# EAGLE design PortExpander (EAGLE 8.2.2)
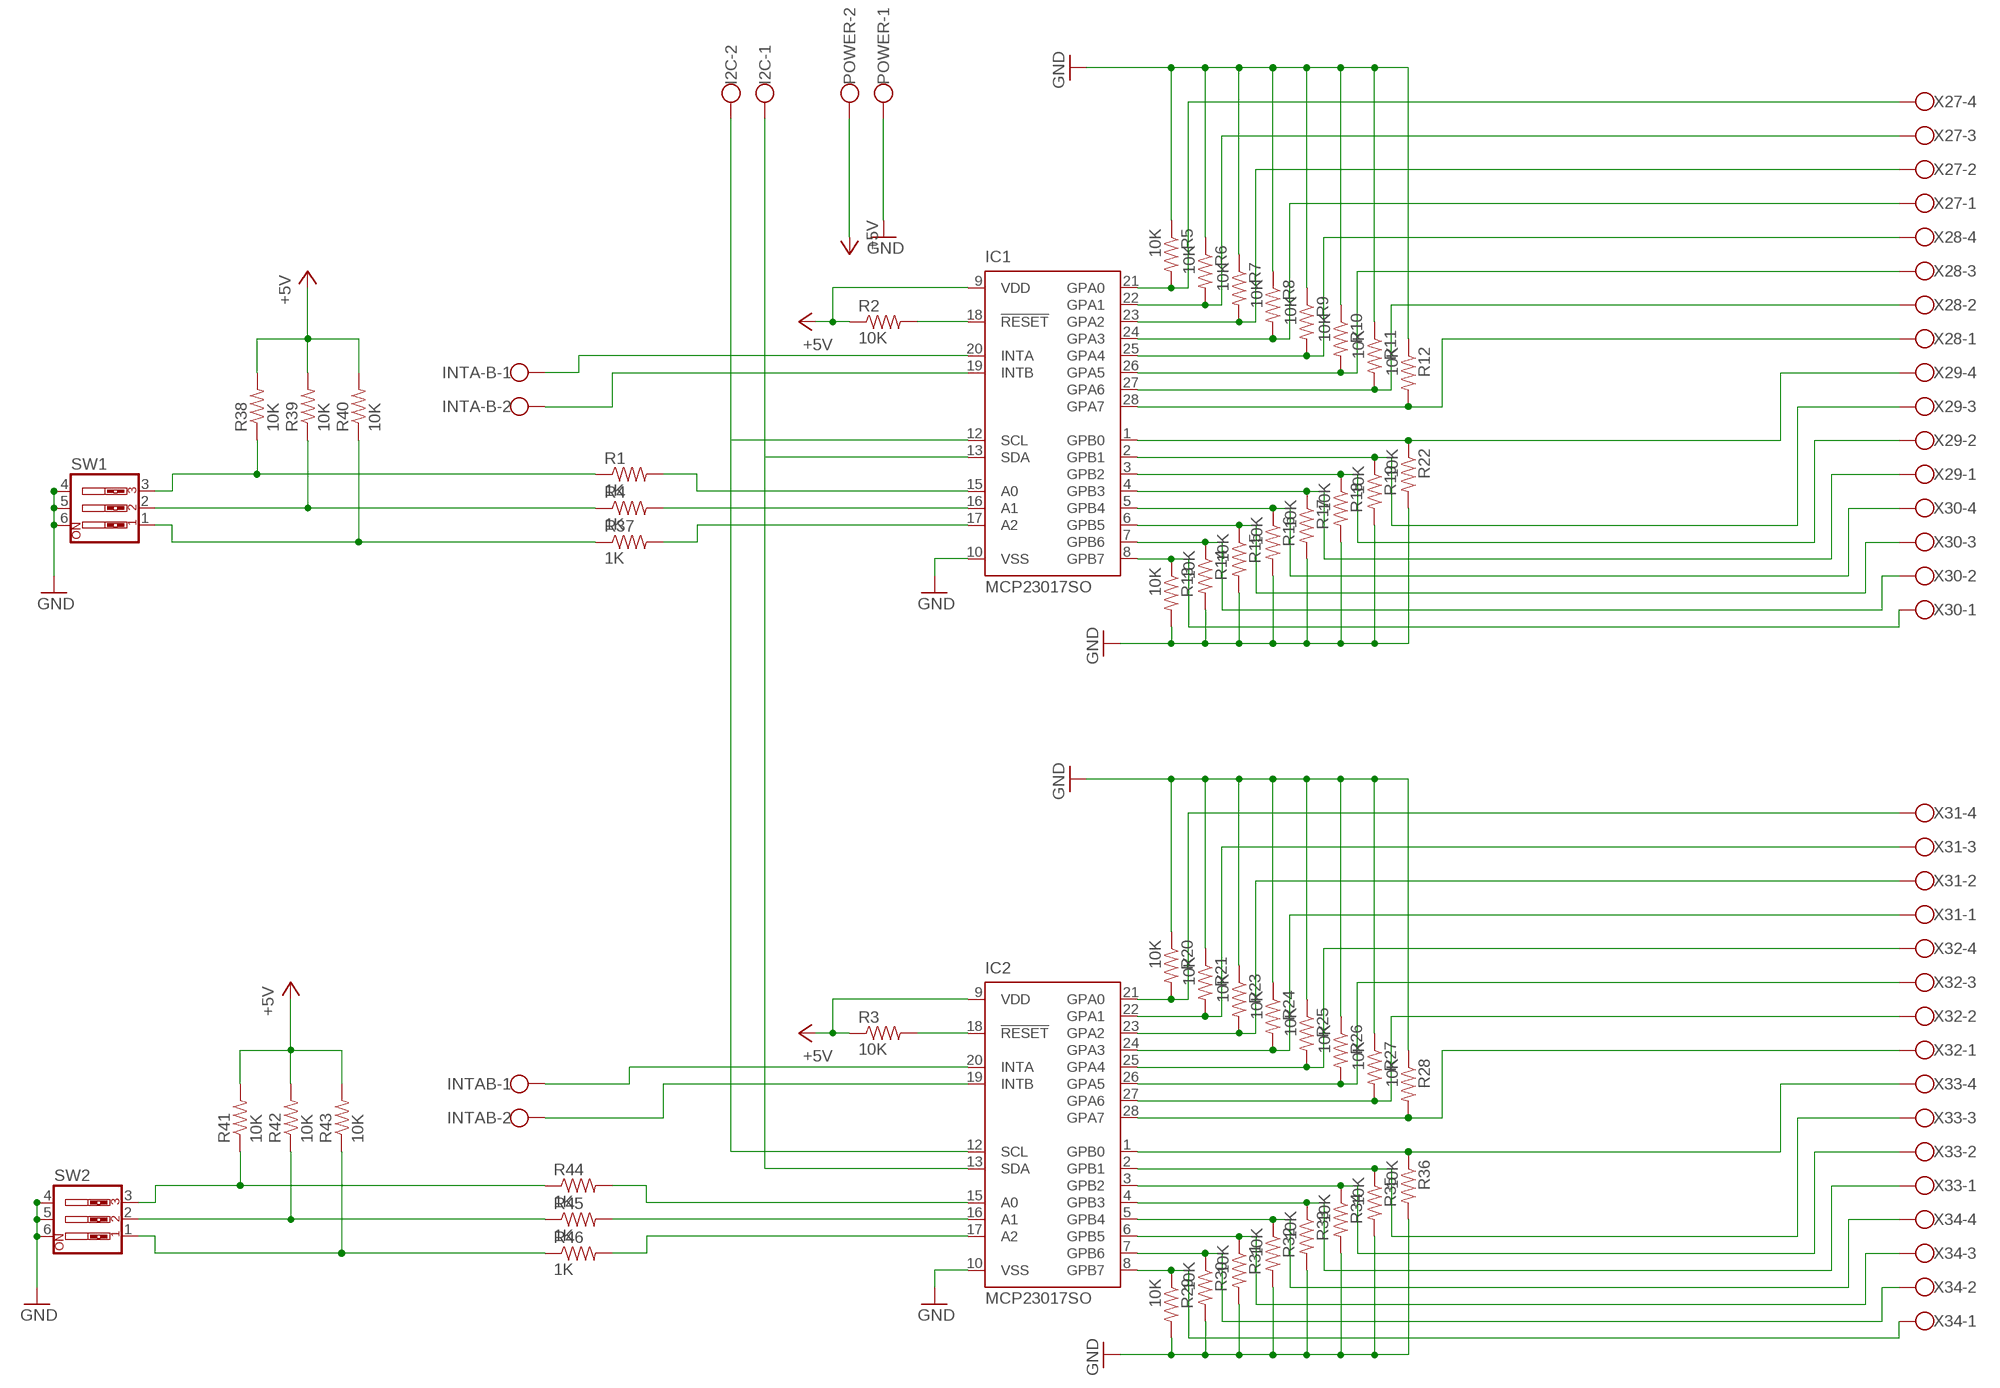
[diagram p0: schematic, sheet 1]

## Parts
I2C  W237-102  [W237-102]
IC1  MCP23017SO  [SO28W]
IC2  MCP23017SO  [SO28W]
INTA-B  W237-102  [W237-102]
INTAB  W237-102  [W237-102]
POWER  W237-102  [W237-102]
R1  1K  RESISTOR1206  [1206]
R2  10K  RESISTOR1206  [1206]
R3  10K  RESISTOR1206  [1206]
R4  1K  RESISTOR1206  [1206]
R5  10K  RESISTOR1206  [1206]
R6  10K  RESISTOR1206  [1206]
R7  10K  RESISTOR1206  [1206]
R8  10K  RESISTOR1206  [1206]
R9  10K  RESISTOR1206  [1206]
R10  10K  RESISTOR1206  [1206]
R11  10K  RESISTOR1206  [1206]
R12  10K  RESISTOR1206  [1206]
R13  10K  RESISTOR1206  [1206]
R14  10K  RESISTOR1206  [1206]
R15  10K  RESISTOR1206  [1206]
R16  10K  RESISTOR1206  [1206]
R17  10K  RESISTOR1206  [1206]
R18  10K  RESISTOR1206  [1206]
R19  10K  RESISTOR1206  [1206]
R20  10K  RESISTOR1206  [1206]
R21  10K  RESISTOR1206  [1206]
R22  10K  RESISTOR1206  [1206]
R23  10K  RESISTOR1206  [1206]
R24  10K  RESISTOR1206  [1206]
R25  10K  RESISTOR1206  [1206]
R26  10K  RESISTOR1206  [1206]
R27  10K  RESISTOR1206  [1206]
R28  10K  RESISTOR1206  [1206]
R29  10K  RESISTOR1206  [1206]
R30  10K  RESISTOR1206  [1206]
R31  10K  RESISTOR1206  [1206]
R32  10K  RESISTOR1206  [1206]
R33  10K  RESISTOR1206  [1206]
R34  10K  RESISTOR1206  [1206]
R35  10K  RESISTOR1206  [1206]
R36  10K  RESISTOR1206  [1206]
R37  1K  RESISTOR1206  [1206]
R38  10K  RESISTOR1206  [1206]
R39  10K  RESISTOR1206  [1206]
R40  10K  RESISTOR1206  [1206]
R41  10K  RESISTOR1206  [1206]
R42  10K  RESISTOR1206  [1206]
R43  10K  RESISTOR1206  [1206]
R44  1K  RESISTOR1206  [1206]
R45  1K  RESISTOR1206  [1206]
R46  1K  RESISTOR1206  [1206]
SW1  SW_DIP-3  [EDG-03]
SW2  SW_DIP-3  [EDG-03]
X27  W237-4  [W237-4]
X28  W237-4  [W237-4]
X29  W237-4  [W237-4]
X30  W237-4  [W237-4]
X31  W237-4  [W237-4]
X32  W237-4  [W237-4]
X33  W237-4  [W237-4]
X34  W237-4  [W237-4]

## Nets
+5V: IC1.9(VDD) IC2.9(VDD) POWER.2 R2.1 R3.1 R38.2 R39.2 R40.2 R41.2 R42.2 R43.2
GND: IC1.10(VSS) IC2.10(VSS) POWER.1 R5.1 R6.1 R7.1 R8.1 R9.1 R10.1 R11.1 R12.1 R13.2 R14.2 R15.2 R16.2 R17.2 R18.2 R19.2 R20.1 R21.1 R22.2 R23.1 R24.1 R25.1 R26.1 R27.1 R28.1 R29.2 R30.2 R31.2 R32.2 R33.2 R34.2 R35.2 R36.2 SW1.4 SW1.5 SW1.6 SW2.4 SW2.5 SW2.6
GPA0: IC1.21(GPA0) R5.2 X27.4
GPA0-2: IC2.21(GPA0) R20.2 X31.4
GPA1: IC1.22(GPA1) R6.2 X27.3
GPA1-2: IC2.22(GPA1) R21.2 X31.3
GPA2: IC1.23(GPA2) R7.2 X27.2
GPA2-2: IC2.23(GPA2) R23.2 X31.2
GPA3: IC1.24(GPA3) R8.2 X27.1
GPA3-2: IC2.24(GPA3) R24.2 X31.1
GPA4: IC1.25(GPA4) R9.2 X28.4
GPA4-2: IC2.25(GPA4) R25.2 X32.4
GPA5: IC1.26(GPA5) R10.2 X28.3
GPA5-2: IC2.26(GPA5) R26.2 X32.3
GPA6: IC1.27(GPA6) R11.2 X28.2
GPA6-2: IC2.27(GPA6) R27.2 X32.2
GPA7: IC1.28(GPA7) R12.2 X28.1
GPA7-2: IC2.28(GPA7) R28.2 X32.1
GPB0: IC1.1(GPB0) R22.1 X29.4
GPB0-2: IC2.1(GPB0) R36.1 X33.4
GPB1: IC1.2(GPB1) R19.1 X29.3
GPB1-2: IC2.2(GPB1) R35.1 X33.3
GPB2: IC1.3(GPB2) R18.1 X29.2
GPB2-2: IC2.3(GPB2) R34.1 X33.2
GPB3: IC1.4(GPB3) R17.1 X29.1
GPB3-2: IC2.4(GPB3) R33.1 X33.1
GPB4: IC1.5(GPB4) R16.1 X30.4
GPB4-2: IC2.5(GPB4) R32.1 X34.4
GPB5: IC1.6(GPB5) R15.1 X30.3
GPB5-2: IC2.6(GPB5) R31.1 X34.3
GPB6: IC1.7(GPB6) R14.1 X30.2
GPB6-2: IC2.7(GPB6) R30.1 X34.2
GPB7: IC1.8(GPB7) R13.1 X30.1
GPB7-2: IC2.8(GPB7) R29.1 X34.1
INTA: IC1.20(INTA) INTA-B.1
INTA2: IC2.20(INTA) INTAB.1
INTB: IC1.19(INTB) INTA-B.2
INTB2: IC2.19(INTB) INTAB.2
N$5: IC2.15(A0) R44.2
N$7: IC1.15(A0) R1.2
N$8: IC1.16(A1) R4.2
N$9: IC1.17(A2) R37.2
N$10: R1.1 R38.1 SW1.3
N$11: R4.1 R39.1 SW1.2
N$12: R37.1 R40.1 SW1.1
N$13: R41.1 R44.1 SW2.3
N$14: IC2.16(A1) R45.2
N$15: R43.1 R46.1 SW2.1
N$16: R42.1 R45.1 SW2.2
N$17: IC2.17(A2) R46.2
RESET: IC1.18(!RESET) R2.2
RESET-2: IC2.18(!RESET) R3.2
SCL: I2C.1 IC1.13(SDA) IC2.13(SDA)
SDA: I2C.2 IC1.12(SCL) IC2.12(SCL)

## Library data of the parts
I2C INTA-B INTAB POWER = con-wago-500:W237-102: WAGO SCREW CLAMP; MPN: 237-102; OC_FARNELL: unknown; OC_NEWARK: 70K9898
IC1 IC2 = microchip:MCP23017: http://ww1.microchip.com/downloads/en/DeviceDoc/21952a.pdf Source: http://ww1.microchip.com/downloads/en/DeviceDoc/21952a.pdf; MF: MICROCHIP; MPN: MCP23017-E/SO; OC_FARNELL: 1332087; OC_NEWARK: 31K2958
R1-R46 = SparkFun-Passives:RESISTOR: Resistor Basic schematic elements and footprints for 0603, 1206, and PTH resistors.
SW1 SW2 = special:SW_DIP-3: DIP SWITCH
X27-X34 = con-wago-500:W237-4: WAGO SCREW CLAMP; OC_FARNELL: unknown; OC_NEWARK: unknown

## Board
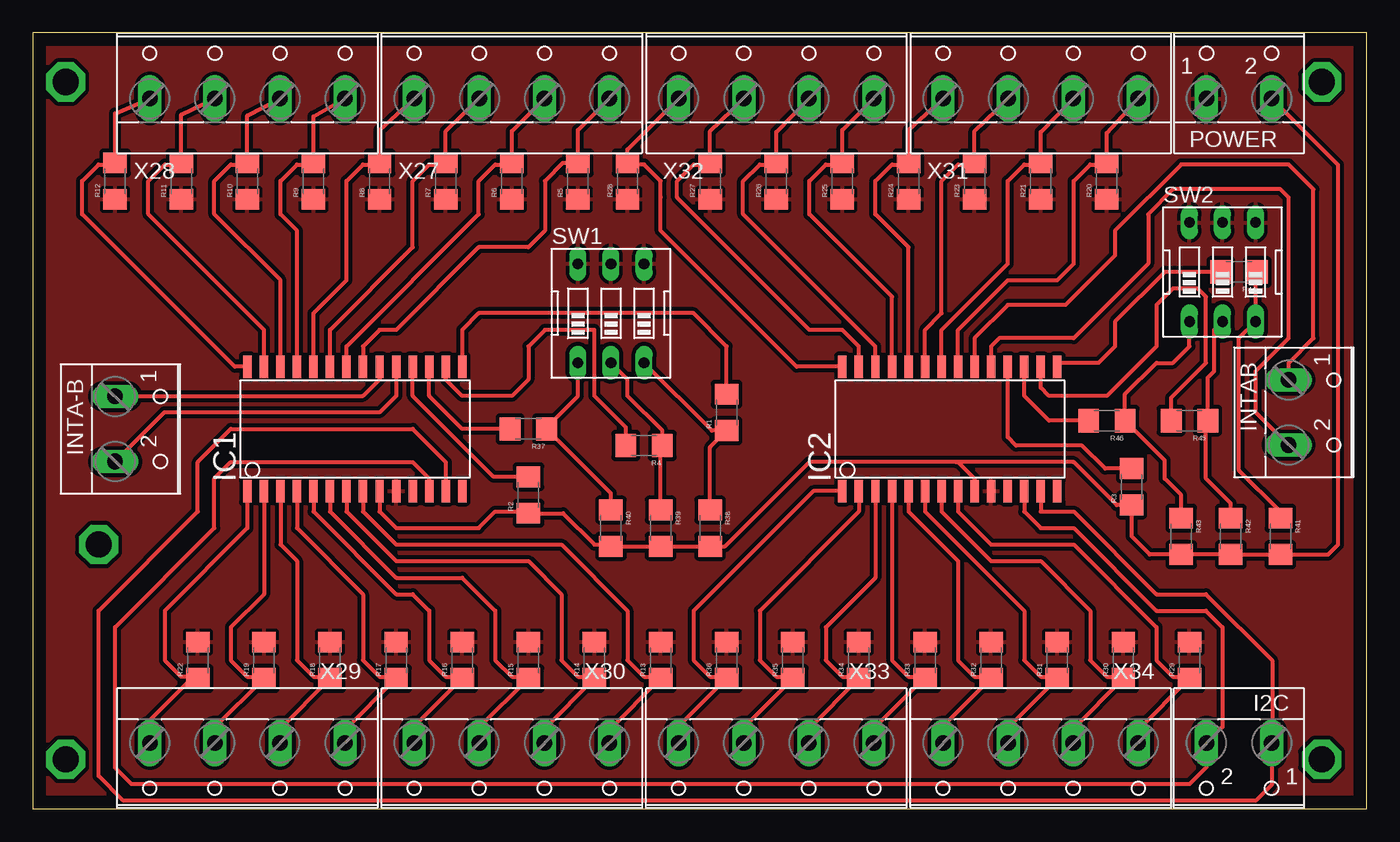
[diagram p1: board, top side]

Size 102.54 x 59.68 mm. Coordinates in mm from the lower left corner, seen from the top.
Outline: 0,0 102.54,0 102.54,59.68 0,59.68 0,0
Copper layers (1*16): Top 0.035mm / dielectric 1.5mm / Bottom 0.035mm
Design rules "default *": minimum track width 0.3mm, minimum drill 0.35mm, track to track 12mil, track to pad 12mil, pad to pad 12mil, via to via 12mil, smd to smd 12mil, copper to edge 40mil, drill to drill 0.3mm, minimum pad ring 10mil, minimum via ring 8mil, stop-mask expansion 8mil, vias tented up to drill 0mil, thermal gap 10mil

### Footprints (pad centres in the part's own frame; a part is rotated, then mirrored left to right if it is on the bottom)
W237-102 = drill 1.194 long: 1 -2.5,-1.27; 2 2.5,-1.27
SO28W = smd 0.65 x 1.7: 1 -7.62,-4.78; 2 -6.35,-4.78; 3 -5.08,-4.78; 4 -3.81,-4.78; 5 -2.54,-4.78; 6 -1.27,-4.78; 7 0,-4.78; 8 1.27,-4.78; 9 2.54,-4.78; 10 3.81,-4.78; 11 5.08,-4.78; 12 6.35,-4.78; 13 7.62,-4.78; 14 8.89,-4.78; 15 8.89,4.78; 16 7.62,4.78; 17 6.35,4.78; 18 5.08,4.78; 19 3.81,4.78; 20 2.54,4.78; 21 1.27,4.78; 22 0,4.78; 23 -1.27,4.78; 24 -2.54,4.78; 25 -3.81,4.78; 26 -5.08,4.78; 27 -6.35,4.78; 28 -7.62,4.78
1206 = smd 1.6 x 1.8: 1 -1.4,0; 2 1.4,0
EDG-03 = drill 0.813 long: 1 -2.54,-3.81; 2 0,-3.81; 3 2.54,-3.81; 4 2.54,3.81; 5 0,3.81; 6 -2.54,3.81
W237-4 = drill 1.194 long: 1 -7.5,-1.27; 2 -2.5,-1.27; 3 2.5,-1.27; 4 7.5,-1.27

### Placement (x,y rotation side)
I2C  92.71,3.81 180 top
IC1  24.13,29.21 0 top
IC2  69.85,29.21 0 top
INTA-B  7.62,29.21 270 top
INTAB  97.79,30.48 270 top
POWER  92.71,55.88 0 top
R1  53.34,30.48 90 top
R2  38.1,24.13 90 top
R3  84.46,24.77 90 top
R4  46.99,27.94 180 top
R5  41.91,48.26 90 top
R6  36.83,48.26 90 top
R7  31.75,48.26 90 top
R8  26.67,48.26 90 top
R9  21.59,48.26 90 top
R10  16.51,48.26 90 top
R11  11.43,48.26 90 top
R12  6.35,48.26 90 top
R13  48.26,11.43 90 top
R14  43.18,11.43 90 top
R15  38.1,11.43 90 top
R16  33.02,11.43 90 top
R17  27.94,11.43 90 top
R18  22.86,11.43 90 top
R19  17.78,11.43 90 top
R20  82.55,48.26 90 top
R21  77.47,48.26 90 top
R22  12.7,11.43 90 top
R23  72.39,48.26 90 top
R24  67.31,48.26 90 top
R25  62.23,48.26 90 top
R26  57.15,48.26 90 top
R27  52.07,48.26 90 top
R28  45.72,48.26 90 top
R29  88.9,11.43 90 top
R30  83.82,11.43 90 top
R31  78.74,11.43 90 top
R32  73.66,11.43 90 top
R33  68.58,11.43 90 top
R34  63.5,11.43 90 top
R35  58.42,11.43 90 top
R36  53.34,11.43 90 top
R37  38.1,29.21 180 top
R38  52.07,21.59 270 top
R39  48.26,21.59 270 top
R40  44.45,21.59 270 top
R41  95.89,20.95 270 top
R42  92.08,20.95 270 top
R43  88.27,20.95 270 top
R44  92.71,41.27 180 top
R45  88.9,29.84 180 top
R46  82.55,29.84 180 top
SW1  44.45,38.1 0 top
SW2  91.44,41.27 0 top
X27  36.83,55.88 0 top
X28  16.51,55.88 0 top
X29  16.51,3.81 180 top
X30  36.83,3.81 180 top
X31  77.47,55.88 0 top
X32  57.15,55.88 0 top
X33  57.15,3.81 180 top
X34  77.47,3.81 180 top

### Tracks (layer width: path | path; a pad name or v marks a point on that pad's centre or on a via)
+5V
  Top 0.305: 70.98,26.67 59.69,26.67 53.21,20.19 R38.2 R39.2 R40.2 44.32,20.32 43.18,20.32 40.77,22.73 R2.1 37.97,22.86 35.56,22.86 34.29,21.59 27.94,21.59 26.67,22.86 IC1.9 | 70.98,26.67 71.12,26.67 72.39,25.4 IC2.9 | 70.98,26.67 80.01,26.67 83.32,23.36 R3.1 84.46,20.95 85.86,19.55 R43.2 R42.2 R41.2 99.57,19.55 100.33,20.32 100.33,49.49 POWER.2
GND
  pour Top: 0,59.69 102.87,59.69 102.87,0 0,0
GPA0
  Top 0.305: IC1.21 25.4,35.56 26.67,36.83 27.94,36.83 34.29,43.18 38.1,43.18 39.37,44.45 39.37,48.26 40.77,49.66 R5.2 41.91,52.19 X27.4
GPA0-2
  Top 0.305: IC2.21 71.12,36.83 74.93,40.64 78.74,40.64 80.01,41.91 80.01,48.26 81.28,49.53 82.42,49.53 R20.2 82.55,51.95 X31.4
GPA1
  Top 0.305: IC1.22 24.13,35.56 34.29,45.72 34.29,48.26 35.56,49.53 36.7,49.53 R6.2 36.83,52.11 X27.3
GPA1-2
  Top 0.305: IC2.22 69.85,36.83 74.93,41.91 74.93,48.26 76.2,49.53 77.34,49.53 R21.2 77.47,52.03 X31.3
GPA2
  Top 0.305: IC1.23 22.86,36.83 29.21,43.18 29.21,48.26 30.48,49.53 31.62,49.53 R7.2 31.75,52.11 X27.2
GPA2-2
  Top 0.305: X31.2 72.39,52.11 R23.2 72.26,49.53 71.12,49.53 69.85,48.26 69.85,38.1 68.58,36.83 IC2.23
GPA3
  Top 0.305: IC1.24 21.59,38.1 24.13,40.64 24.13,48.26 25.4,49.53 26.54,49.53 R8.2 26.67,52.19 X27.1
GPA3-2
  Top 0.305: X31.1 67.31,52.19 R24.2 67.18,49.53 66.04,49.53 64.77,48.26 64.77,45.72 67.31,43.18 IC2.24
GPA4
  Top 0.305: IC1.25 20.32,44.45 19.05,45.72 19.05,48.26 20.32,49.53 21.46,49.53 R9.2 21.59,53.22 X28.4
GPA4-2
  Top 0.305: IC2.25 66.04,39.37 59.69,45.72 59.69,48.26 60.96,49.53 62.1,49.53 R25.2 62.23,52.19 X32.4
GPA5
  Top 0.305: IC1.26 19.05,40.64 13.97,45.72 13.97,48.26 15.24,49.53 16.38,49.53 R10.2 16.51,53.3 X28.3
GPA5-2
  Top 0.305: IC2.26 64.77,35.56 54.61,45.72 54.61,48.26 55.88,49.53 57.02,49.53 R26.2 57.15,52.03 X32.3
GPA6
  Top 0.305: IC1.27 17.78,36.83 8.89,45.72 8.89,48.26 10.16,49.53 11.3,49.53 R11.2 11.43,53.38 X28.2
GPA6-2
  Top 0.305: IC2.27 63.5,35.56 62.23,36.83 59.69,36.83 49.53,46.99 49.53,48.26 50.8,49.53 51.94,49.53 R27.2 52.07,52.11 X32.2
GPA7
  Top 0.305: IC1.28 15.54,33.99 3.81,45.72 3.81,48.26 5.08,49.53 6.22,49.53 R12.2 6.35,53.46 X28.1
GPA7-2
  Top 0.305: 48.26,47.03 48.26,46.99 | 48.26,47.03 48.26,48.26 46.99,49.53 45.85,49.53 R28.2 45.72,50.68 X32.1 | 48.26,47.03 48.26,44.45 58.72,33.99 IC2.28
GPB0
  Top 0.305: IC1.1 16.51,21.59 10.16,15.24 10.16,11.43 11.43,10.16 12.34,10.16 | 12.34,10.16 12.57,10.16 R22.1 | X29.4 9.01,6.83 12.34,10.16
GPB0-2
  Top 0.305: IC2.1 59.99,24.43 50.8,15.24 50.8,11.43 52.07,10.16 53.21,10.16 R36.1 49.65,6.34 X33.4
GPB1
  Top 0.305: IC1.2 17.78,16.51 15.24,13.97 15.24,11.43 16.51,10.16 17.65,10.16 R19.1 14.01,6.26 X29.3
GPB1-2
  Top 0.305: IC2.2 63.5,22.86 55.88,15.24 55.88,11.43 57.15,10.16 58.29,10.16 R35.1 54.65,6.26 X33.3
GPB2
  Top 0.305: IC1.3 19.05,20.32 20.32,19.05 20.32,11.43 21.59,10.16 22.73,10.16 R18.1 19.01,6.18 X29.2
GPB2-2
  Top 0.305: IC2.3 64.77,17.78 60.96,13.97 60.96,11.43 62.23,10.16 63.37,10.16 R34.1 59.65,6.18 X33.2
GPB3
  Top 0.305: IC1.4 20.32,21.59 25.4,16.51 25.4,11.43 26.67,10.16 27.81,10.16 R17.1 24.01,6.1 X29.1
GPB3-2
  Top 0.305: IC2.4 66.04,11.43 67.31,10.16 68.45,10.16 68.53,10.08 | 68.53,10.08 R33.1 | X33.1 64.65,6.19 68.53,10.08
GPB4
  Top 0.305: IC1.5 21.59,22.86 27.94,16.51 29.21,16.51 30.48,15.24 30.48,11.43 31.75,10.16 32.89,10.16 R16.1 29.33,6.34 X30.4
GPB4-2
  Top 0.305: IC2.5 67.31,22.86 71.12,19.05 71.12,11.43 72.39,10.16 73.53,10.16 R32.1 69.97,6.34 X34.4
GPB5
  Top 0.305: IC1.6 22.86,22.86 27.94,17.78 33.02,17.78 35.56,15.24 35.56,11.43 36.83,10.16 37.97,10.16 R15.1 34.33,6.26 X30.3
GPB5-2
  Top 0.305: IC2.6 68.58,22.86 76.2,15.24 76.2,11.43 77.47,10.16 78.61,10.16 R31.1 74.97,6.26 X34.3
GPB6
  Top 0.305: IC1.7 24.13,22.86 27.94,19.05 38.1,19.05 40.64,16.51 40.64,11.43 41.91,10.16 43.05,10.16 R14.1 39.33,6.18 X30.2
GPB6-2
  Top 0.305: IC2.7 69.85,22.86 73.66,19.05 77.47,19.05 81.28,15.24 81.28,11.43 82.55,10.16 83.69,10.16 R30.1 79.97,6.18 X34.2
GPB7
  Top 0.305: IC1.8 25.4,22.86 27.94,20.32 40.64,20.32 45.72,15.24 45.72,11.43 46.99,10.16 48.13,10.16 R13.1 44.33,6.1 X30.1
GPB7-2
  Top 0.305: IC2.8 71.12,22.86 73.66,20.32 80.01,20.32 86.36,13.97 86.36,11.43 87.63,10.16 88.77,10.16 R29.1 84.97,6.1 X34.1
INTA
  Top 0.305: IC1.20 26.67,33.02 25.4,31.75 7.62,31.75 7.58,31.71 INTA-B.1
INTA2
  Top 0.305: INTAB.1 96.52,34.29 98.43,36.2 98.43,47.62 96.52,49.53 88.27,49.53 83.19,44.45 83.19,42.55 79.38,38.73 74.93,38.73 72.39,36.2 IC2.20
INTB
  Top 0.305: IC1.19 27.94,31.75 26.67,30.48 10.12,30.48 INTA-B.2
INTB2
  Top 0.305: INTAB.2 96.48,27.98 93.98,30.48 93.98,33.66 96.52,36.2 96.52,46.99 95.89,47.62 87.63,47.62 85.73,45.72 85.73,41.91 80.01,36.2 74.3,36.2 73.66,35.56 IC2.19
N$1  (via drill 2)
  other vias: 2.54,55.88
N$2  (via drill 2)
  other vias: 99.06,3.81
N$3  (via drill 2)
  other vias: 99.06,55.88
N$4  (via drill 2)
  other vias: 5.08,20.32
N$5
  Top 0.305: R44.2 87,41.27 83.19,37.47 83.19,35.56 81.92,34.29 79.04,34.29 IC2.15
N$6  (via drill 2)
  other vias: 2.54,3.81
N$7
  Top 0.305: R1.2 53.34,35.56 50.8,38.1 34.29,38.1 33.02,36.83 IC1.15
N$8
  Top 0.305: R4.2 45.59,29.34 43.18,31.75 43.18,36.83 39.37,36.83 38.1,35.56 38.1,33.02 36.83,31.75 33.02,31.75 31.75,33.02 IC1.16
N$9
  Top 0.305: R37.2 33.02,29.21 30.48,31.75 IC1.17
N$10
  Top 0.305: R38.1 52.07,27.81 R1.1 52.2,29.08 SW1.3
N$11
  Top 0.305: R39.1 48.26,27.81 R4.1 48.39,29.08 45.72,31.75 45.72,33.02 SW1.2
N$12
  Top 0.305: R40.1 44.45,24.26 R37.1 39.5,29.34 41.91,31.75 SW1.1
N$13
  Top 0.305: R44.1 93.98,41.15 SW2.3 92.71,36.2 92.71,26.04 95.89,22.86 R41.1
N$14
  Top 0.305: R45.2 87.5,31.62 90.17,34.29 90.17,39.37 89.54,40.01 87.63,40.01 86.36,38.73 86.36,35.56 82.55,31.75 78.11,31.75 77.47,32.38 IC2.16
N$15
  Top 0.305: R43.1 88.27,24.13 87,25.4 87,26.8 R46.1 83.95,31.88 86.36,34.29 87.63,34.29 88.9,35.56 SW2.1
N$16
  Top 0.305: R42.1 92.08,23.5 90.17,25.4 90.17,29.71 R45.1 90.3,33.15 90.81,33.66 90.81,36.83 SW2.2
N$17
  Top 0.305: R46.2 78.11,29.84 76.2,31.75 IC2.17
RESET
  Top 0.305: R2.2 35.43,25.53 29.21,31.75 IC1.18
RESET-2
  Top 0.305: R3.2 82.42,26.16 80.65,27.94 75.57,27.94 74.93,28.57 IC2.18
SCL
  Top 0.305: IC2.13 77.47,22.86 80.01,22.86 86.36,16.51 90.17,16.51 95.25,11.43 95.25,5.12 I2C.1 95.21,1.86 93.98,0.64 6.99,0.64 5.08,2.54 5.08,15.24 12.7,22.86 12.7,26.67 15.24,29.21 29.21,29.21 31.75,26.67 IC1.13
SDA
  Top 0.305: IC2.12 76.2,22.86 77.47,21.59 80.01,21.59 86.36,15.24 90.17,15.24 91.44,13.97 91.44,6.31 I2C.2 90.21,3.21 88.9,1.91 7.62,1.91 6.35,3.17 6.35,13.97 13.97,21.59 13.97,25.4 15.24,26.67 29.21,26.67 30.48,25.4 IC1.12